# Altium schematic sheet Sheet.SchDoc
size A4; SheetNumber: 1; SheetTotal: 1
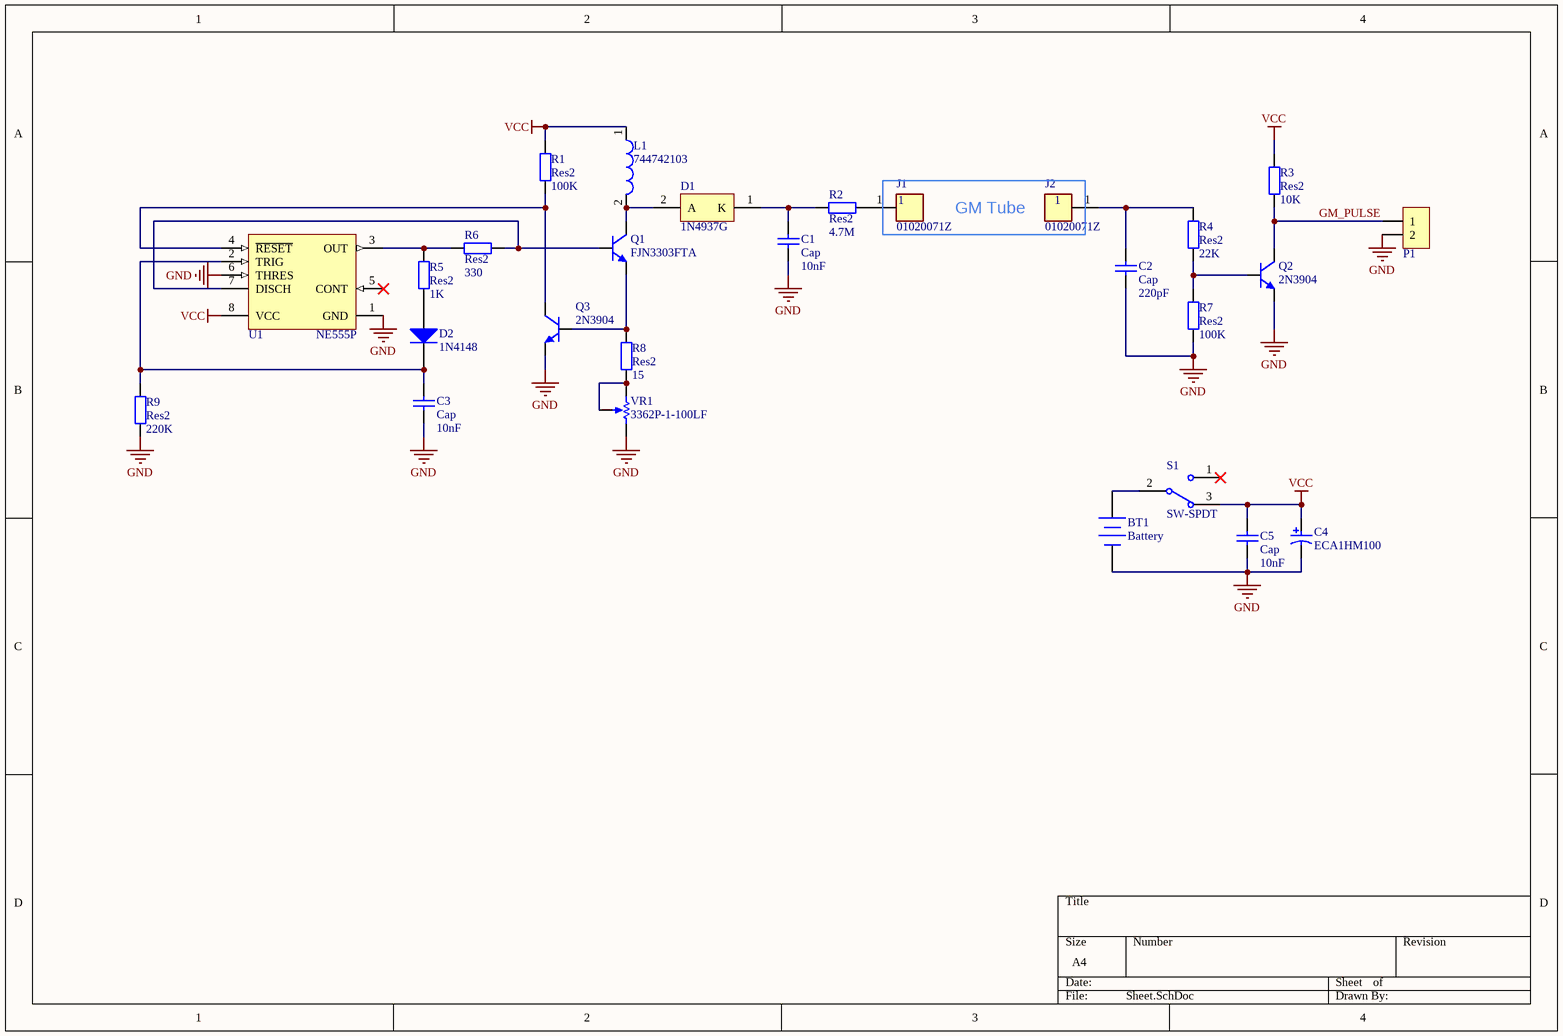
[diagram p0: Sheet.SchDoc]

## Parts
BT1  Battery  [BAT-2]
C1  Cap  value 10nF  [RAD-0.2]
C2  Cap  value 220pF  [RAD-0.2]
C3  Cap  value 10nF  [RAD-0.2]
C4  ECA1HM100  [CAPPR55-200-1100X500X1200]
C5  Cap  value 10nF  [RAD-0.1]
D1  1N4937G  [ONSC-AXIAL_LEAD-2-59-10_P]
D2  1N4148  [NXP-SOD27-2_V]
J1  01020071Z  [FP-102-MFG]
J2  01020071Z  [FP-102-MFG]
L1  744742103  [WE-TI-L]
P1  HDR-1X2  [XH2.54-2P_H]  (value not drawn)
Q1  FJN3303FTA  [TO92B]
Q2  2N3904  [TO92B]
Q3  2N3904  [TO92B]
R1  Res2  value 100K  [AXIAL-0.4]
R2  Res2  value 4.7M  [AXIAL-0.4]
R3  Res2  value 10K  [AXIAL-0.4]
R4  Res2  value 22K  [AXIAL-0.4]
R5  Res2  value 1K  [AXIAL-0.4]
R6  Res2  value 330  [AXIAL-0.4]
R7  Res2  value 100K  [AXIAL-0.4]
R8  Res2  value 15  [AXIAL-0.4]
R9  Res2  value 220K  [AXIAL-0.4]
S1  SW-SPDT  [SW-TH_SK12D07VG4]
U1  NE555P  [P0008A]
VR1  3362P-1-100LF  [BOUR-3362P]

## Blocks framed on the sheet
GM Tube: J1 J2

## Nets
GND: BT1.2(-) C1.1 C2.1 C3.1 C4.2 C5.1 P1.2 Q2.1(E) Q3.1(E) R7.1 R9.1 U1.1(GND) U1.6(THRES) VR1.3(CW)
VCC: C4.1 C5.2 L1.1 R1.2 R3.2 S1.3 U1.8(VCC)
GM_PULSE: P1.1 Q2.3(C) R3.1
NetBT1_1: BT1.1(+) S1.2
NetC1_2: C1.2 D1.1(K) R2.2
NetC2_2: C2.2 J2.1 R4.2
NetC3_2: C3.2 D2.2(K) R9.2 U1.2(TRIG)
NetD1_2: D1.2(A) L1.2 Q1.3(C)
NetD2_1: D2.1(A) R5.1
NetJ1_1: J1.1 R2.1
NetQ1_1: Q1.1(E) Q3.2(B) R8.2
NetQ1_2: Q1.2(B) R6.2 U1.7(DISCH)
NetQ2_2: Q2.2(B) R4.1 R7.2
NetQ3_3: Q3.3(C) R1.1 U1.4(~{RESET})
NetR5_2: R5.2 R6.1 U1.3(OUT)
NetR8_1: R8.1 VR1.1(CCW) VR1.2(S)

Not connected (* = marked no-connect by the designer): S1 1*; U1 5(CONT)*

## Library data of the parts
BT1 = Battery: Multicell Battery; Published: 24-Mar-1999; LatestRevisionDate: 17-Jul-2002; LatestRevisionNote: Re-released for DXP Platform.; PackageReference: BAT-2; Publisher: Altium Limited; PackageDescription: Battery; 2 Leads
C1-C3 C5 = Cap: Capacitor; Published: 8-Jun-2000; LatestRevisionDate: 17-Jul-2002; LatestRevisionNote: Re-released for DXP Platform.; PackageReference: RAD-0.3; Publisher: Altium Limited; PackageDescription: Radial Cap, Thru-Hole; 2 Leads; 0.3 in Pin Spacing
C4 = CMP-1665-00038-2: Aluminum Electrolytic Capacitor, 10 uF, +/- 20%, 50 V, -40 to 85 degC, 2-Pin THD, RoHS, Bulk; Manufacturer: Panasonic; Life (Hours): 2000Hour; Lead/Base Style: Straight; Dissipation Factor: 0.12%; Capacitance: 10uF; Leakage Current: 3uA; Dielectric Material: Aluminium; Lead Diameter: 0.5mm; Voltage Rating: 50V; Ripple Current: 65mA; Package Reference: CAPPR55-200-1100X500X1200; Height: 11mm; Diameter: 5mm; REACH SVHC: NoSVHC; Mount: ThroughHole; Packaging: Bulk; Manufacturer URL: http://www.panasonic.com/; Termination: Radial; Datasheet URL: https://industrial.panasonic.com/cdbs/www-data/pdf/RDF0000/ABA0000C1218.pdf; Lead Free: LeadFree; Height - Seated (Max): 0.472inch; Case/Package: Radial; Package Description: 2-Pin Radial Lead, Dia 5 mm, Height 12 mm; Tolerance: 20%; Datasheet Version: Rev. 05, 10/2016; Package Quantity: 200; Ripple Current (AC): 65mA; Min Operating Temperature: -40degC; RoHSCompliant: true; Number of Pins: 2; Max Operating Temperature: 85degC; Voltage: 50V; Lead Pitch: 2mm; Radiation Hardening: No; Voltage Rating (DC): 50V; Length: 11mm
D1 = CMP-0902-00178-1: Fast-Recovery Rectifier, 2-Pin Axial_Lead, Pb-Free, Bulk Bag; Manufacturer: On Semiconductor; VRRM Max (V): 600; IO(rec) Max (A): 1; Type: Fast Recovery; IFSM Max (A): 30; ComponentLink1Description: Manufacturer URL; PartNumber: 1N4937G; Packing: Bulk Bag; PackageDescription: 2-Pin, Axial Lead, Diameter 2.35 mm; ComponentLink3URL: http://www.onsemi.cn/pub_link/Collateral/59-10.PDF; RoHS: TRUE; DatasheetVersion: Rev. 12; ComponentLink2Description: Datasheet; Mounting Technology: Through Hole; PackageReference: AXIAL_LEAD-2-59-10; ComponentLink1URL: http://www.onsemi.com/; ComponentLink3Description: Package Specification; PackageVersion: Rev. U, 02/2005; ComponentLink2URL: http://www.onsemi.com/pub_link/Collateral/1N4933-D.PDF
D2 = CMP-0648-00002-1: High-speed Diode, 100 V, 450 mA, 2-Pin SOD27, RoHS; Manufacturer: NXP Semiconductors; Configuration: Single; IR (VR: 20 V)=25 nA; IFRM: 450 mA; IFSM: 4 A Max.; Trr: 4 ns Max.; Cd: 4 pF Max.; VR: 100 V Max.; VF (IF: 10 mA)=1 V; IF: 200 mA Max.; ComponentLink1Description: Manufacturer URL; RoHS: TRUE; ComponentLink1URL: http://www.nxp.com/; ComponentLink3Description: Package Specification; DatasheetVersion: Aug-04; ComponentLink2Description: Datasheet; PackageVersion: Aug-04; PackageReference: SOD27; ComponentLink3URL: http://www.nxp.com/documents/data_sheet/1N4148_1N4448.pdf; Mounting Technology: Through Hole; ComponentLink2URL: http://www.nxp.com/documents/data_sheet/1N4148_1N4448.pdf; PartNumber: 1N4148; PackageDescription: 2-Pin Hermetically Sealed Glass Package, Axial Leaded, Dia 1.85 mm, Body Length 4.25 mm, Lead Spread 25.4 mm
J1 J2 = CMP-08604-000017-1: FUSE CLIP CARTRIDGE 250V 15A PCB; Manufacturer: Littelfuse Inc; Is Female: yes; Number Of Fuses: 1; Conn Orientation: Vertical; ComponentLink2Description: Datasheet; Mouser Description: Fuse Clips ACS 3AG PC CLIP; RoHS: TRUE; Package: 102; Category: Fuse; Voltage Rating Dc: 250V; Digikey Description: FUSE CLIP CARTRIDGE 250V 15A PCB; Automotive: No; Device Class L1: Circuit Protection; Octopart: https://octopart.com/01020071z-littelfuse-18837869; Device Class L2: Fuse Holders; Height: 10.67mm; Manufacturer Part Number: 01020071Z; Voltage Rating Ac: 250V; ComponentLink2URL: https://www.littelfuse.com/~/media/electronics/datasheets/fuse_clips/littelfuse_fuse_clip_102_122_datasheet.pdf.pdf; Fuse Current: 15A; Device Class L3: unset; Lead Free: Yes
L1 = CMP-1405-00035-1: Radial Leaded Wire Wound Inductor WE-TI, L=10000 µH; Manufacturer: Wuerth Elektronik; Inductance: 10000 ÂµH; ComponentLink1URL: http://www.we-online.com; ComponentLink1Description: Manufacturer URL; PartNumber: 744742103; ComponentLink2URL: http://www.we-online.de/katalog/media/pdf/744742103.pdf; PackageDescription: THT Inductor, 2-Leads, Body 7.8 x 7.8 mm; ComponentLink2Description: Datasheet; PackageReference: WE-TI-L
P1 = Header 2: 2P接插件; 版权归属: 源创客; BOM名称: 2P接插件; 学习资源: www.ooocke.com
Q1 = 8050-DIP: 高频放大-NPN型; pin to pad: 2>3 3>2; 版权归属: 源创客; 属性: 40V 1.5A 1W 100MHZ; BOM名称: 高频放大-NPN型; 学习资源: www.ooocke.com
Q2 Q3 = 8050-DIP: 高频放大-NPN型; 版权归属: 源创客; 属性: 40V 1.5A 1W 100MHZ; BOM名称: 高频放大-NPN型; 学习资源: www.ooocke.com
R1-R9 = Res2: Resistor; Published: 8-Jun-2000; LatestRevisionDate: 17-Jul-2002; LatestRevisionNote: Re-released for DXP Platform.; PackageReference: AXIAL-0.4; Publisher: Altium Limited; PackageDescription: Axial Device, Thru-Hole; 2 Leads; 0.4 in Pin Spacing
S1 = SW-SPDT: SPDT Subminiature Toggle Switch, Right Angle Mounting, Vertical Actuation; Published: 24-Mar-1999; LatestRevisionDate: 17-Dec-2003; LatestRevisionNote: Schematic revised, PCB Footprint replaced.; DatasheetVersion: 05-Dec-2000; PackageReference: TL36WW15050; Publisher: Altium Limited; PackageDescription: Switch; 4 Leads; ComponentLink1Description: Manufacturer Link; ComponentLink1URL: http://www.apem.com
U1 = CMP-2000-04954-1: Precision Timer, 4.5 to 16 V, 0 to 70 degC, 8-Pin DIP, Pb-Free, Tube; Manufacturer: TexasInstruments; Maximum High Level Output Current: -200mA; Number of Internal Timers: 1; Operating Supply Voltage: 5; Maximum Low Level Output Current: 200mA; Rad Hard: No; Packaging: Rail/Tube; Manufacturer URL: http://www.ti.com/; Package Reference: P8; Package Description: 8-Pin Double In-line Package, Body 9.59 x 6.35 mm, Pitch 2.54 mm; Package URL: http://www.ti.com/lit/ml/mpdi001b/mpdi001b.pdf; Type: Standard; Datasheet URL: http://www.ti.com/general/docs/lit/getliterature.tsp?genericPartNumber=NE555&fileType=pdf; Category: Timer; Package: 8PDIP; Datasheet Version: Rev. I, 09/2014
VR1 = CMP-1747-00004-1: Res Cermet Trimmer 10 Ohm 10% 1/2W 1(Elec)/1(Mech)Turn 2.77mm (6.6 X 6.99 X 4.7mm) Pin Thru-Hole Tube; Voltage Rating: 220 mV; Power Rating: 500 mW; Tolerance: 1%; Resistance: 50 mohm; Case/Package: 1206; Length: 3.2 mm; RoHSCompliant: True; PackageDescription: 3-Pin Through Hole Device, Body 6.6 x 6.99 mm, Pitch 2.54 mm; ComponentLink2Description: Datasheet; REACH SVHC: No SVHC; Mount: Surface Mount; Height: 0.6 mm; Packaging: Tape and Reel; ComponentLink1URL: http://www.bourns.com/; Case Code (Imperial): 0612; Pins: 2; Case Code (Metric): 1632; ComponentLink2URL: http://www.bourns.com/docs/Product-Datasheets/3362.pdf; Min Operating Temperature: -25degC; ComponentLink1Description: Manufacturer URL; PackageReference: 3326P; Max Operating Temperature: 125degC; Width: 1.6 mm; Package Quantity: 5000; DatasheetVersion: May-16